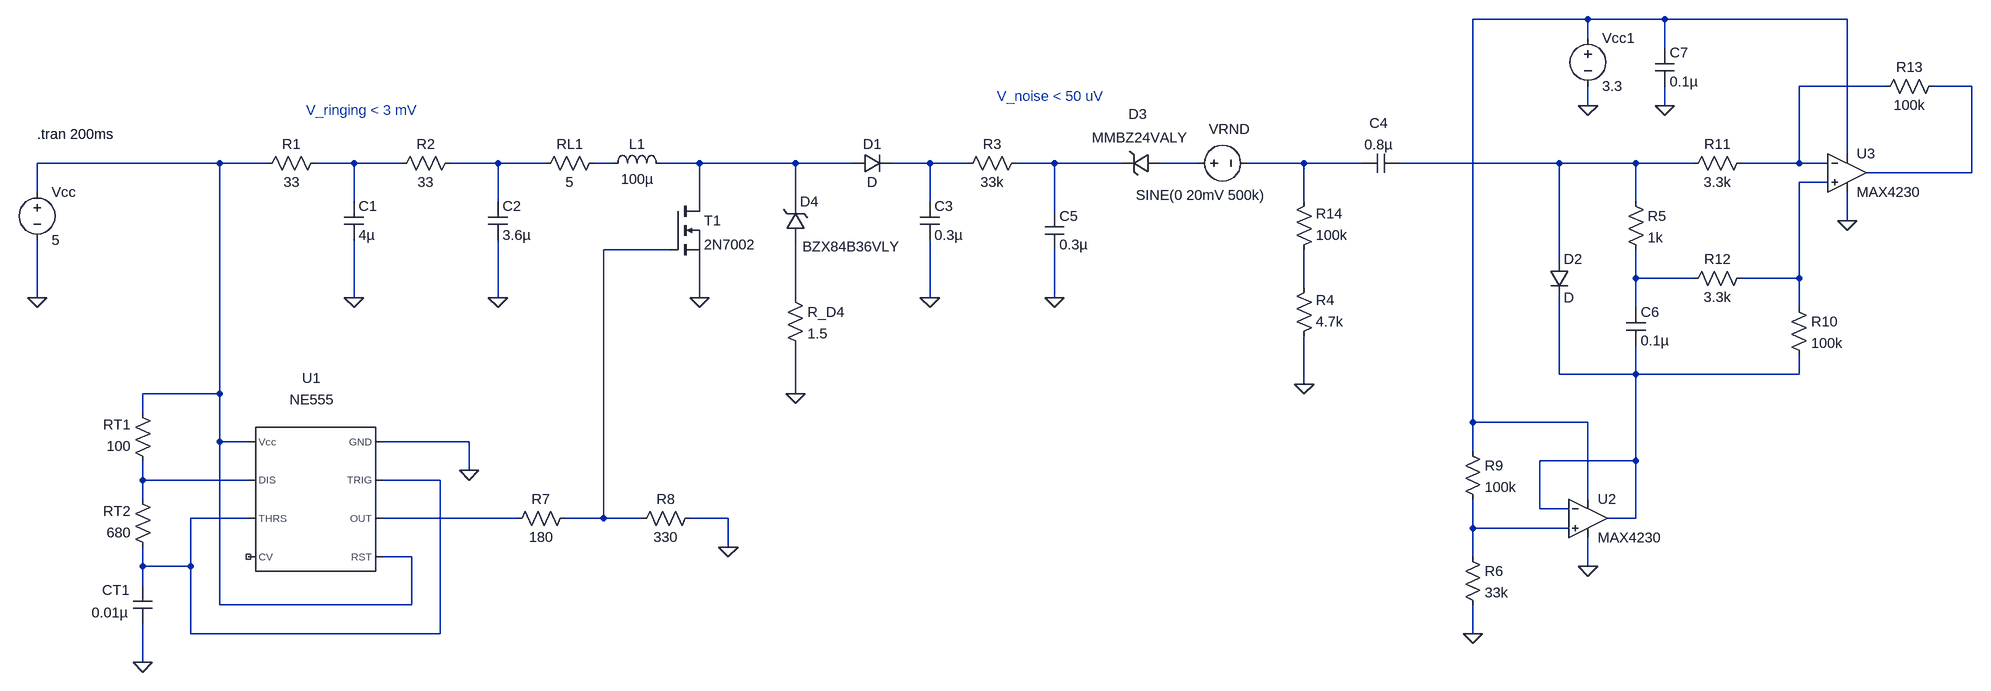
[diagram p0: schematic BoostPump5_WaveExtractor_derated_tmp1.asc]
BoostPump5_WaveExtractor_derated_tmp1.asc, the LTspice schematic file:
Version 4
SHEET 1 3252 772
WIRE 2608 -320 2416 -320
WIRE 2736 -320 2608 -320
WIRE 3040 -320 2736 -320
WIRE 2608 -288 2608 -320
WIRE 2736 -272 2736 -320
WIRE 3104 -208 2960 -208
WIRE 3248 -208 3184 -208
WIRE 2608 -176 2608 -208
WIRE 2736 -176 2736 -208
WIRE 3040 -96 3040 -320
WIRE -400 -80 -704 -80
WIRE -320 -80 -400 -80
WIRE -176 -80 -240 -80
WIRE -96 -80 -176 -80
WIRE 64 -80 -16 -80
WIRE 144 -80 64 -80
WIRE 256 -80 224 -80
WIRE 400 -80 336 -80
WIRE 560 -80 400 -80
WIRE 656 -80 560 -80
WIRE 784 -80 720 -80
WIRE 848 -80 784 -80
WIRE 992 -80 928 -80
WIRE 1104 -80 992 -80
WIRE 1232 -80 1168 -80
WIRE 1408 -80 1312 -80
WIRE 1504 -80 1408 -80
WIRE 2560 -80 1568 -80
WIRE 2688 -80 2560 -80
WIRE 2784 -80 2688 -80
WIRE 2960 -80 2960 -208
WIRE 2960 -80 2864 -80
WIRE 3008 -80 2960 -80
WIRE 3248 -64 3248 -208
WIRE 3248 -64 3072 -64
WIRE 3008 -48 2960 -48
WIRE -704 -32 -704 -80
WIRE -176 -16 -176 -80
WIRE 64 -16 64 -80
WIRE 400 -16 400 -80
WIRE 560 -16 560 -80
WIRE 784 -16 784 -80
WIRE 1408 -16 1408 -80
WIRE 2688 -16 2688 -80
WIRE 992 0 992 -80
WIRE 3040 16 3040 -32
WIRE 352 64 240 64
WIRE 2560 80 2560 -80
WIRE 2688 112 2688 64
WIRE 2784 112 2688 112
WIRE 2960 112 2960 -48
WIRE 2960 112 2864 112
WIRE 1408 128 1408 64
WIRE -704 144 -704 48
WIRE -176 144 -176 48
WIRE 64 144 64 48
WIRE 400 144 400 80
WIRE 560 144 560 48
WIRE 784 144 784 48
WIRE 992 144 992 64
WIRE 2688 160 2688 112
WIRE 2960 160 2960 112
WIRE 2560 272 2560 144
WIRE 2688 272 2688 224
WIRE 2688 272 2560 272
WIRE 2960 272 2960 240
WIRE 2960 272 2688 272
WIRE 1408 288 1408 208
WIRE -400 304 -400 -80
WIRE -400 304 -528 304
WIRE 560 304 560 224
WIRE -528 336 -528 304
WIRE 2416 352 2416 -320
WIRE 2608 352 2416 352
WIRE -400 384 -400 304
WIRE -352 384 -400 384
WIRE 16 384 -128 384
WIRE 2416 400 2416 352
WIRE 2688 416 2688 272
WIRE 2688 416 2528 416
WIRE 16 432 16 384
WIRE -528 448 -528 416
WIRE -352 448 -528 448
WIRE -32 448 -128 448
WIRE -528 480 -528 448
WIRE 2608 480 2608 352
WIRE 2528 496 2528 416
WIRE 2576 496 2528 496
WIRE -352 512 -448 512
WIRE 96 512 -128 512
WIRE 240 512 240 64
WIRE 240 512 176 512
WIRE 304 512 240 512
WIRE 448 512 384 512
WIRE 2688 512 2688 416
WIRE 2688 512 2640 512
WIRE 2416 528 2416 480
WIRE 2576 528 2416 528
WIRE 448 560 448 512
WIRE -80 576 -128 576
WIRE 2416 576 2416 528
WIRE -528 592 -528 560
WIRE -448 592 -448 512
WIRE -448 592 -528 592
WIRE 2608 592 2608 544
WIRE -528 624 -528 592
WIRE -400 656 -400 384
WIRE -80 656 -80 576
WIRE -80 656 -400 656
WIRE -448 704 -448 592
WIRE -32 704 -32 448
WIRE -32 704 -448 704
WIRE 2416 704 2416 656
WIRE -528 752 -528 688
FLAG 64 144 0
FLAG 400 144 0
FLAG 784 144 0
FLAG -704 144 0
FLAG 560 304 0
FLAG 992 144 0
FLAG -176 144 0
FLAG -528 752 0
FLAG 16 432 0
FLAG 448 560 0
FLAG 2416 704 0
FLAG 3040 16 0
FLAG 2608 592 0
FLAG 2608 -176 0
FLAG 2736 -176 0
FLAG 1408 288 0
SYMBOL res 0 -96 R90
WINDOW 0 0 56 VBottom 2
WINDOW 3 32 56 VTop 2
SYMATTR InstName R2
SYMATTR Value 33
SYMBOL res 240 -96 R90
WINDOW 0 0 56 VBottom 2
WINDOW 3 32 56 VTop 2
SYMATTR InstName RL1
SYMATTR Value 5
SYMBOL cap 48 -16 R0
SYMATTR InstName C2
SYMATTR Value 3.6µ
SYMBOL cap 768 -16 R0
SYMATTR InstName C3
SYMATTR Value 0.3µ
SYMBOL ind 240 -64 R270
WINDOW 0 32 56 VTop 2
WINDOW 3 5 56 VBottom 2
SYMATTR InstName L1
SYMATTR Value 100µ
SYMBOL diode 656 -64 R270
WINDOW 0 32 32 VTop 2
WINDOW 3 0 32 VBottom 2
SYMATTR InstName D1
SYMBOL nmos 352 -16 R0
SYMATTR InstName T1
SYMATTR Value 2N7002
SYMBOL voltage -704 -48 R0
WINDOW 123 0 0 Left 0
WINDOW 39 0 0 Left 0
SYMATTR InstName Vcc
SYMATTR Value 5
SYMBOL res 944 -96 R90
WINDOW 0 0 56 VBottom 2
WINDOW 3 32 56 VTop 2
SYMATTR InstName R3
SYMATTR Value 33k
SYMBOL zener 1168 -96 R90
WINDOW 0 -50 37 VBottom 2
WINDOW 3 -42 34 VTop 2
SYMATTR InstName D3
SYMATTR Value MMBZ24VALY
SYMBOL cap -192 -16 R0
SYMATTR InstName C1
SYMATTR Value 4µ
SYMBOL res -224 -96 R90
WINDOW 0 0 56 VBottom 2
WINDOW 3 32 56 VTop 2
SYMATTR InstName R1
SYMATTR Value 33
SYMBOL Misc\\NE555 -240 480 M0
WINDOW 0 7 -202 Center 2
WINDOW 3 6 -166 Center 2
SYMATTR InstName U1
SYMBOL cap -544 624 R0
WINDOW 0 -52 8 Left 2
WINDOW 3 -69 45 Left 2
SYMATTR InstName CT1
SYMATTR Value 0.01µ
SYMBOL res -512 576 R180
WINDOW 0 36 76 Left 2
WINDOW 3 36 40 Left 2
SYMATTR InstName RT2
SYMATTR Value 680
SYMBOL res 192 496 R90
WINDOW 0 0 56 VBottom 2
WINDOW 3 32 56 VTop 2
SYMATTR InstName R7
SYMATTR Value 180
SYMBOL res 400 496 R90
WINDOW 0 0 56 VBottom 2
WINDOW 3 32 56 VTop 2
SYMATTR InstName R8
SYMATTR Value 330
SYMBOL res -512 432 R180
WINDOW 0 36 76 Left 2
WINDOW 3 36 40 Left 2
SYMATTR InstName RT1
SYMATTR Value 100
SYMBOL zener 544 48 M180
WINDOW 0 24 64 Left 2
WINDOW 3 28 -11 Left 2
SYMATTR InstName D4
SYMATTR Value BZX84B36VLY
SYMBOL cap 976 0 R0
SYMATTR InstName C5
SYMATTR Value 0.3µ
SYMBOL res 544 128 R0
SYMATTR InstName R_D4
SYMATTR Value 1.5
SYMBOL voltage 1216 -80 M90
WINDOW 123 0 0 Left 0
WINDOW 39 0 0 Left 0
WINDOW 0 -57 101 VLeft 2
WINDOW 3 53 126 VLeft 2
SYMATTR InstName VRND
SYMATTR Value SINE(0 20mV 500k)
SYMBOL cap 1568 -96 R90
WINDOW 0 -35 36 VBottom 2
WINDOW 3 -30 36 VTop 2
SYMATTR InstName C4
SYMATTR Value 0.8µ
SYMBOL res 2672 -32 R0
SYMATTR InstName R5
SYMATTR Value 1k
SYMBOL OpAmps\\MAX4230 2608 448 R0
SYMATTR InstName U2
SYMBOL OpAmps\\MAX4230 3040 -128 R0
SYMATTR InstName U3
SYMBOL res 2400 560 R0
SYMATTR InstName R6
SYMATTR Value 33k
SYMBOL res 2400 384 R0
SYMATTR InstName R9
SYMATTR Value 100k
SYMBOL res 2944 144 R0
SYMATTR InstName R10
SYMATTR Value 100k
SYMBOL res 2880 -96 R90
WINDOW 0 0 56 VBottom 2
WINDOW 3 32 56 VTop 2
SYMATTR InstName R11
SYMATTR Value 3.3k
SYMBOL res 2880 96 R90
WINDOW 0 0 56 VBottom 2
WINDOW 3 32 56 VTop 2
SYMATTR InstName R12
SYMATTR Value 3.3k
SYMBOL res 3200 -224 R90
WINDOW 0 0 56 VBottom 2
WINDOW 3 32 56 VTop 2
SYMATTR InstName R13
SYMATTR Value 100k
SYMBOL cap 2672 160 R0
SYMATTR InstName C6
SYMATTR Value 0.1µ
SYMBOL voltage 2608 -304 R0
WINDOW 123 0 0 Left 0
WINDOW 39 0 0 Left 0
SYMATTR InstName Vcc1
SYMATTR Value 3.3
SYMBOL cap 2720 -272 R0
SYMATTR InstName C7
SYMATTR Value 0.1µ
SYMBOL res 1392 80 M180
WINDOW 0 36 76 Left 2
WINDOW 3 36 40 Left 2
SYMATTR InstName R14
SYMATTR Value 100k
SYMBOL res 1392 224 M180
WINDOW 0 36 76 Left 2
WINDOW 3 36 40 Left 2
SYMATTR InstName R4
SYMATTR Value 4.7k
SYMBOL diode 2544 80 R0
SYMATTR InstName D2
TEXT -704 -128 Left 2 !.tran 200ms
TEXT -256 -168 Left 2 ;V_ringing < 3 mV
TEXT 896 -192 Left 2 ;V_noise < 50 uV

The netlist it stands for:
* BoostPump5_WaveExtractor_derated_tmp1.asc
R2 N006 N005 33
RL1 N007 N006 5
C2 N006 0 3.6µ
C3 N009 0 0.3µ
L1 N007 N008 100µ
D1 N008 N009 D
M§T1 N008 N015 0 0 2N7002
Vcc N004 0 5
R3 N010 N009 33k
D3 N011 N010 MMBZ24VALY
C1 N005 0 4µ
R1 N005 N004 33
XU1 0 N021 N022 N004 NC_01 N021 N020 N004 NE555  ; pins GND TRIG OUT RST CV THRS DIS Vcc
CT1 N021 0 0.01µ
RT2 N021 N020 680
R7 N015 N022 180
R8 0 N015 330
RT1 N020 N004 100
D4 N018 N008 BZX84B36VLY
C5 N010 0 0.3µ
R_D4 N018 0 1.5
VRND N011 N012 SINE(0 20mV 500k)
C4 N013 N012 0.8µ
R5 N013 N016 1k
XU2 N023 N019 N001 0 N019 MAX4230  ; pins In+ In- V+ V- OUT
XU3 N014 N002 N001 0 N003 MAX4230  ; pins In+ In- V+ V- OUT
R6 N023 0 33k
R9 N001 N023 100k
R10 N014 N019 100k
R11 N002 N013 3.3k
R12 N014 N016 3.3k
R13 N003 N002 100k
C6 N016 N019 0.1µ
Vcc1 N001 0 3.3
C7 N001 0 0.1µ
R14 N017 N012 100k
R4 0 N017 4.7k
D2 N013 N019 D
.model D D
.lib standard.dio
.model NMOS NMOS
.model PMOS PMOS
.lib standard.mos
.tran 200ms
* V_ringing < 3 mV
* V_noise < 50 uV
.lib NE555.sub
.lib MAX4230.lib
.backanno
.end